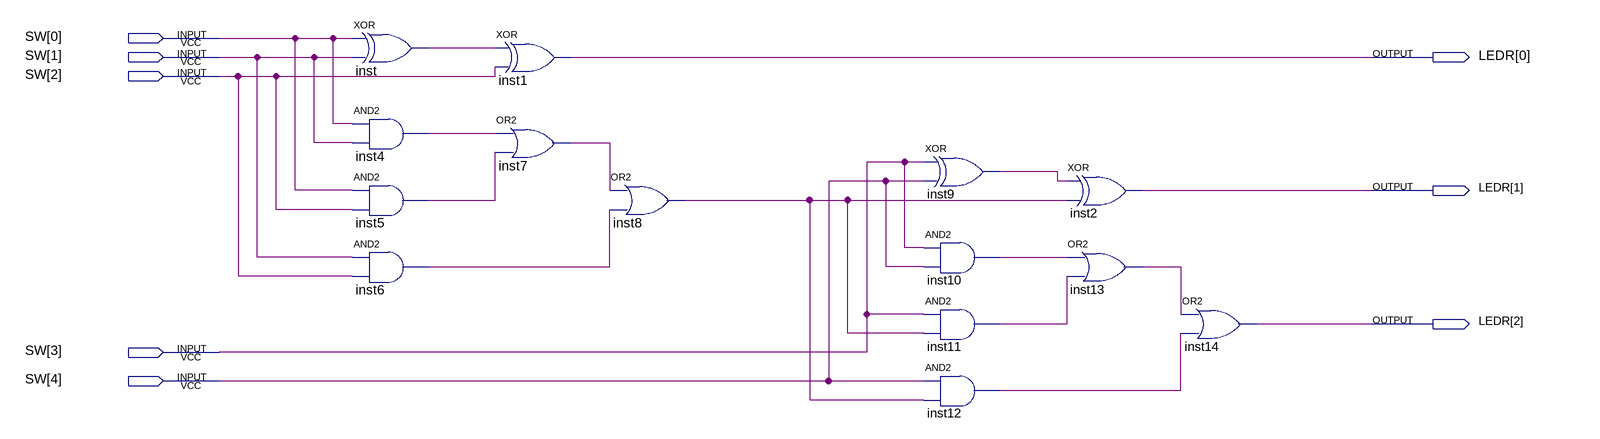
[diagram p0: schematic sheet]
// Quartus schematic DoubleAdder.bdf as structural Verilog: 14 symbols, 8 pins
module DoubleAdder (
  input  [4:0] SW,
  output [2:0] LEDR
);

  wire inst4_out, inst5_out, inst6_out, inst7_out, inst8_out, inst9_out, inst10_out, inst11_out, inst12_out,
       inst13_out, inst_out;

  xor inst (inst_out, SW[0], SW[1]);
  and inst4 (inst4_out, SW[0], SW[1]);
  and inst5 (inst5_out, SW[0], SW[2]);
  and inst6 (inst6_out, SW[1], SW[2]);
  xor inst1 (LEDR[0], inst_out, SW[2]);
  or inst7 (inst7_out, inst4_out, inst5_out);
  or inst8 (inst8_out, inst7_out, inst6_out);
  xor inst9 (inst9_out, SW[3], SW[4]);
  and inst10 (inst10_out, SW[3], SW[4]);
  and inst11 (inst11_out, SW[3], inst8_out);
  and inst12 (inst12_out, SW[4], inst8_out);
  xor inst2 (LEDR[1], inst9_out, inst8_out);
  or inst13 (inst13_out, inst10_out, inst11_out);
  or inst14 (LEDR[2], inst13_out, inst12_out);
endmodule
